# Altium schematic sheet FPGA.SchDoc
size A3; SheetNumber: 2; SheetTotal: 4
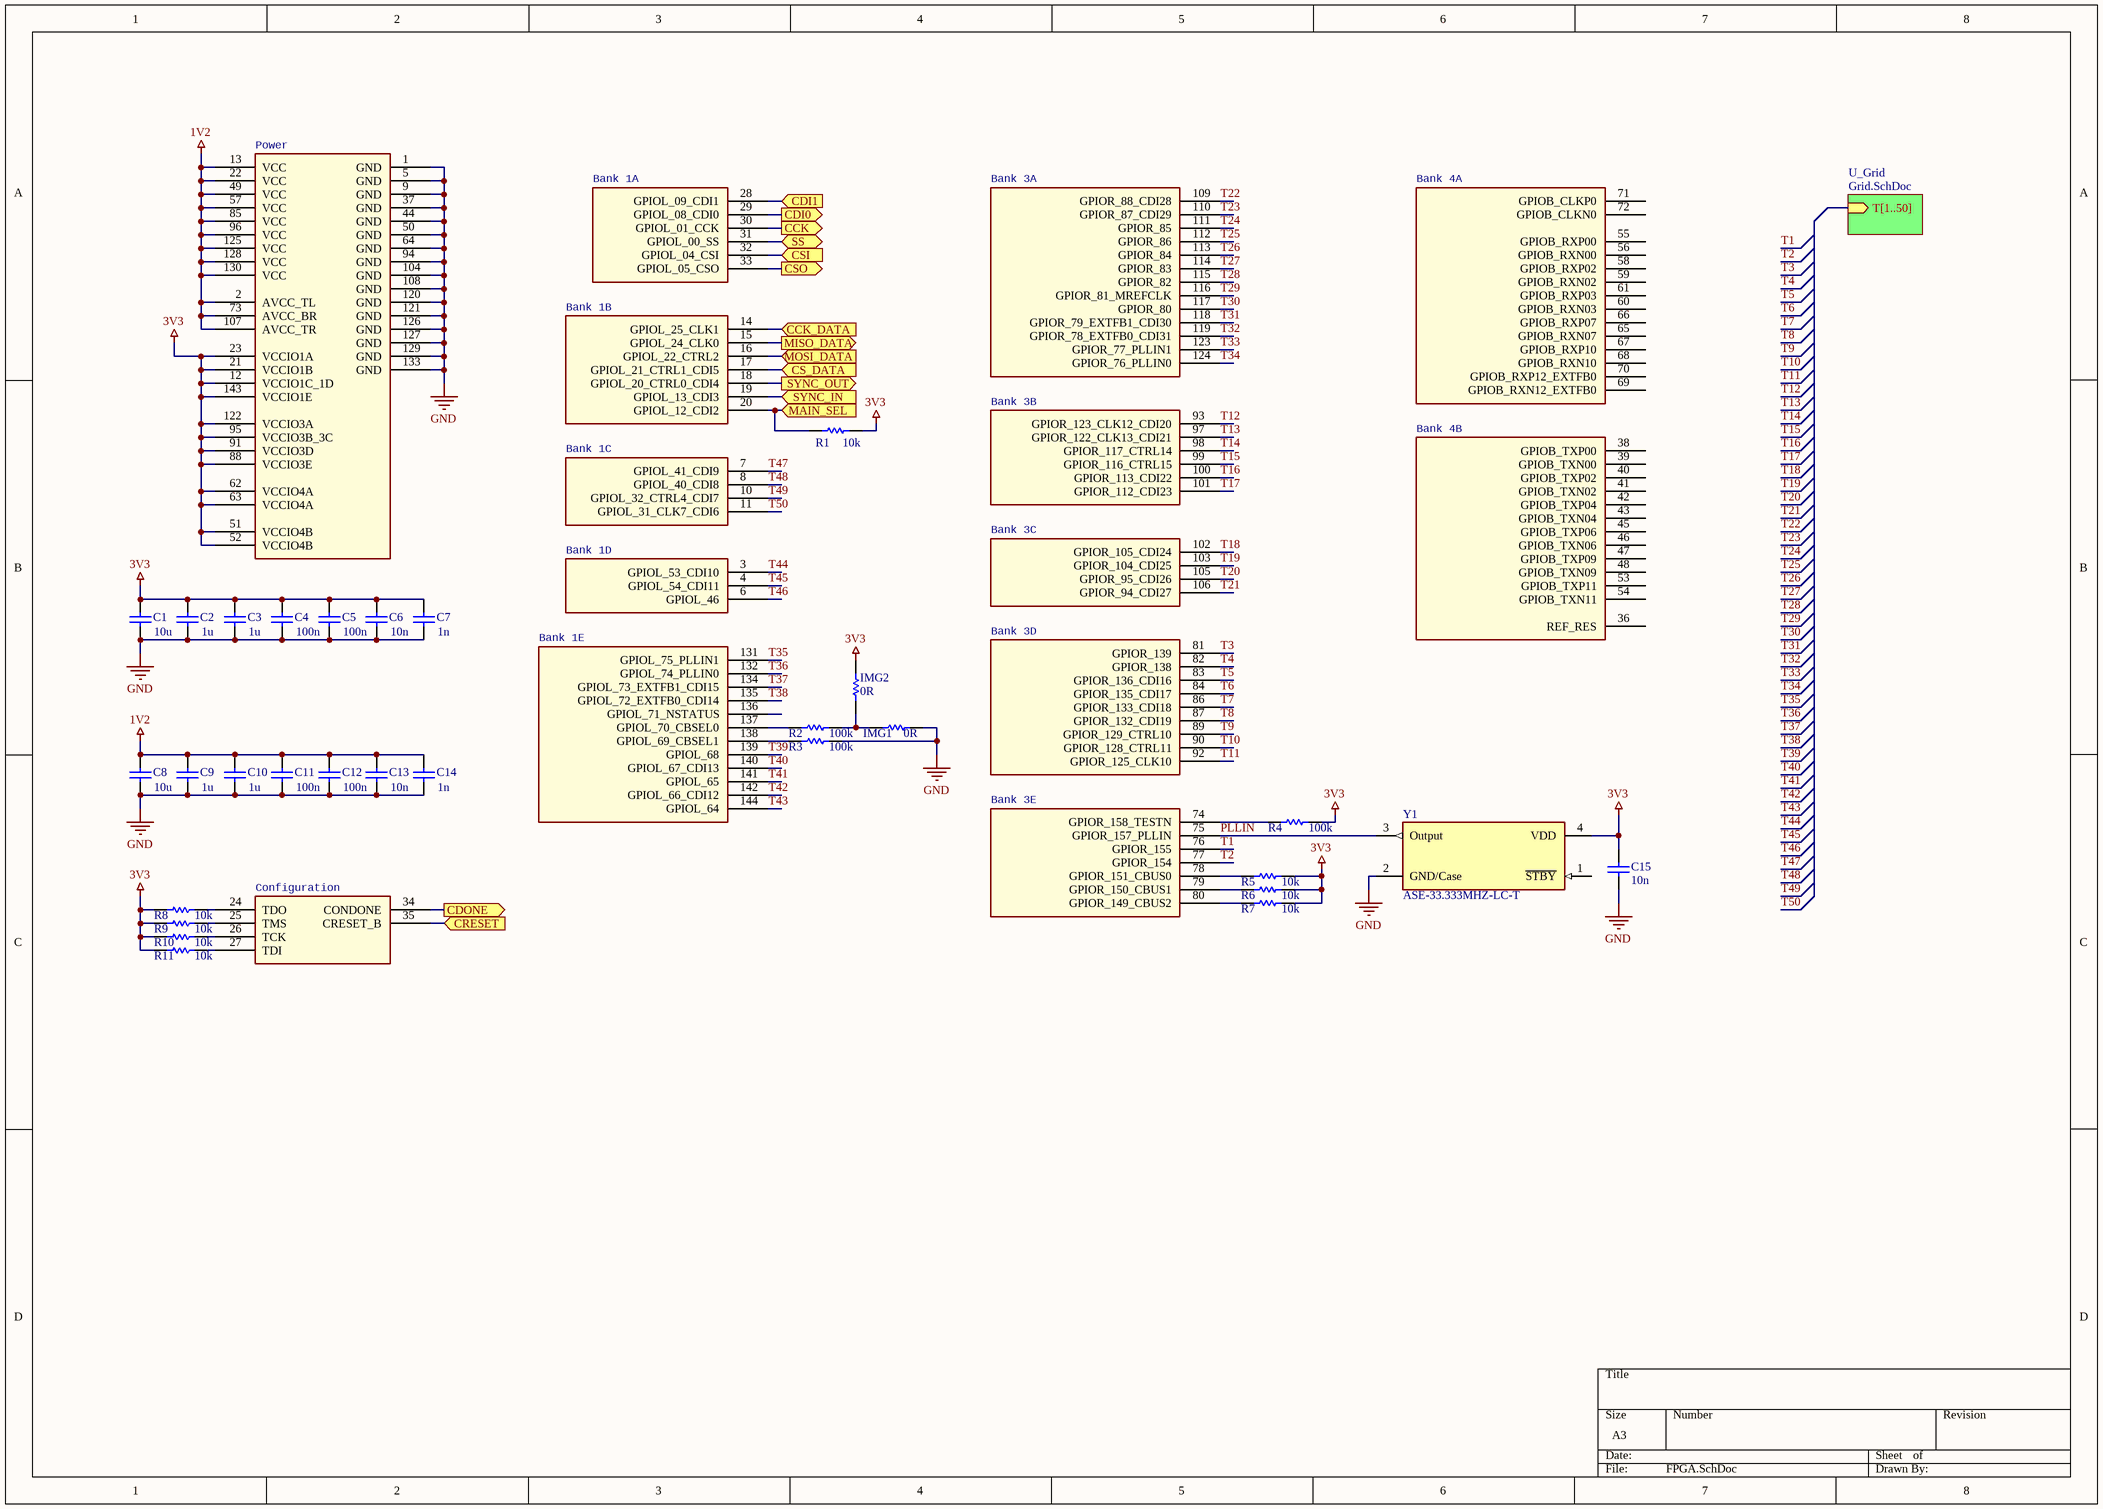
[diagram p0: FPGA.SchDoc]

## Parts
C1  10u  [SAMS-C0603-2_M]
C2  1u  [SAMS-C0603-2_M]
C3  1u  [SAMS-C0603-2_M]
C4  100n  [SAMS-C0603-2_M]
C5  100n  [SAMS-C0603-2_M]
C6  10n  [SAMS-C0603-2_M]
C7  1n  [SAMS-C0603-2_M]
C8  10u  [SAMS-C0603-2_M]
C9  1u  [SAMS-C0603-2_M]
C10  1u  [SAMS-C0603-2_M]
C11  100n  [SAMS-C0603-2_M]
C12  100n  [SAMS-C0603-2_M]
C13  10n  [SAMS-C0603-2_M]
C14  1n  [SAMS-C0603-2_M]
C15  10n  [SAMS-C0603-2_M]
IMG1  0R  [RESC1005X40X20NL05T10]
IMG2  0R  [RESC1005X40X20NL05T10]
R1  10k  [RESC1609X55X30LL15T15]
R2  100k  [RESC1609X55X30LL15T15]
R3  100k  [RESC1609X55X30LL15T15]
R4  100k  [RESC1609X55X30LL15T15]
R5  10k  [RESC1609X55X30LL15T15]
R6  10k  [RESC1609X55X30LL15T15]
R7  10k  [RESC1609X55X30LL15T15]
R8  10k  [RESC1609X55X30LL15T15]
R9  10k  [RESC1609X55X30LL15T15]
R10  10k  [RESC1609X55X30LL15T15]
R11  10k  [RESC1609X55X30LL15T15]
U1  T8Q144Cx  [LQFP144]  (value not drawn)  (parts A,B,C,D,E,F,G,H,I,J,K,L,M,N of 14)
Y1  ASE-33.333MHZ-LC-T  [FP-ASE-MFG]

## Sub-sheets
U_Grid = Grid.SchDoc: T[1..50] (in)

## Ports
CCK (out), CCK_DATA (in), CDI0 (out), CDI1 (in), CDONE (out), CRESET (in), CS_DATA (in), CSI (in), CSO (out), MAIN_SEL (in), MISO_DATA (out), MOSI_DATA (in), SS (bidir), SYNC_IN (in), SYNC_OUT (out)

## Nets
1V2: C8.1 C9.1 C10.1 C11.1 C12.1 C13.1 C14.1 U1.2(AVCC_TL) U1.13(VCC) U1.22(VCC) U1.49(VCC) U1.57(VCC) U1.73(AVCC_BR) U1.85(VCC) U1.96(VCC) U1.107(AVCC_TR) U1.125(VCC) U1.128(VCC) U1.130(VCC)
3V3: C1.1 C2.1 C3.1 C4.1 C5.1 C6.1 C7.1 C15.2 IMG2.2 R1.1 R4.2 R5.2 R6.2 R7.2 R8.1 R9.1 R10.1 R11.1 U1.12(VCCIO1C_1D) U1.21(VCCIO1B) U1.23(VCCIO1A) U1.51(VCCIO4B) U1.52(VCCIO4B) U1.62(VCCIO4A) U1.63(VCCIO4A) U1.88(VCCIO3E) U1.91(VCCIO3D) U1.95(VCCIO3B_3C) U1.122(VCCIO3A) U1.143(VCCIO1E) Y1.4(VDD)
GND: C1.2 C2.2 C3.2 C4.2 C5.2 C6.2 C7.2 C8.2 C9.2 C10.2 C11.2 C12.2 C13.2 C14.2 C15.1 IMG1.2 R3.2 U1.1(GND) U1.5(GND) U1.9(GND) U1.37(GND) U1.44(GND) U1.50(GND) U1.64(GND) U1.94(GND) U1.104(GND) U1.108(GND) U1.120(GND) U1.121(GND) U1.126(GND) U1.127(GND) U1.129(GND) U1.133(GND) Y1.2(GND/Case)
CCK: U1.30(GPIOL_01_CCK) ; port CCK
CCK_DATA: U1.14(GPIOL_25_CLK1) ; port CCK_DATA
CDI0: U1.29(GPIOL_08_CDI0) ; port CDI0
CDI1: U1.28(GPIOL_09_CDI1) ; port CDI1
CDONE: U1.34(CONDONE) ; port CDONE
CRESET: U1.35(CRESET_B) ; port CRESET
CS_DATA: U1.17(GPIOL_21_CTRL1_CDI5) ; port CS_DATA
CSI: U1.32(GPIOL_04_CSI) ; port CSI
CSO: U1.33(GPIOL_05_CSO) ; port CSO
MAIN_SEL: R1.2 U1.20(GPIOL_12_CDI2) ; port MAIN_SEL
MISO_DATA: U1.15(GPIOL_24_CLK0) ; port MISO_DATA
MOSI_DATA: U1.16(GPIOL_22_CTRL2) ; port MOSI_DATA
PLLIN: U1.75(GPIOR_157_PLLIN) Y1.3(Output)
SS: U1.31(GPIOL_00_SS) ; port SS
SYNC_IN: U1.19(GPIOL_13_CDI3) ; port SYNC_IN
SYNC_OUT: U1.18(GPIOL_20_CTRL0_CDI4) ; port SYNC_OUT
T1: U1.76(GPIOR_155)
T2: U1.77(GPIOR_154)
T3: U1.81(GPIOR_139)
T4: U1.82(GPIOR_138)
T5: U1.83(GPIOR_136_CDI16)
T6: U1.84(GPIOR_135_CDI17)
T7: U1.86(GPIOR_133_CDI18)
T8: U1.87(GPIOR_132_CDI19)
T9: U1.89(GPIOR_129_CTRL10)
T10: U1.90(GPIOR_128_CTRL11)
T11: U1.92(GPIOR_125_CLK10)
T12: U1.93(GPIOR_123_CLK12_CDI20)
T13: U1.97(GPIOR_122_CLK13_CDI21)
T14: U1.98(GPIOR_117_CTRL14)
T15: U1.99(GPIOR_116_CTRL15)
T16: U1.100(GPIOR_113_CDI22)
T17: U1.101(GPIOR_112_CDI23)
T18: U1.102(GPIOR_105_CDI24)
T19: U1.103(GPIOR_104_CDI25)
T20: U1.105(GPIOR_95_CDI26)
T21: U1.106(GPIOR_94_CDI27)
T22: U1.109(GPIOR_88_CDI28)
T23: U1.110(GPIOR_87_CDI29)
T24: U1.111(GPIOR_85)
T25: U1.112(GPIOR_86)
T26: U1.113(GPIOR_84)
T27: U1.114(GPIOR_83)
T28: U1.115(GPIOR_82)
T29: U1.116(GPIOR_81_MREFCLK)
T30: U1.117(GPIOR_80)
T31: U1.118(GPIOR_79_EXTFB1_CDI30)
T32: U1.119(GPIOR_78_EXTFB0_CDI31)
T33: U1.123(GPIOR_77_PLLIN1)
T34: U1.124(GPIOR_76_PLLIN0)
T35: U1.131(GPIOL_75_PLLIN1)
T36: U1.132(GPIOL_74_PLLIN0)
T37: U1.134(GPIOL_73_EXTFB1_CDI15)
T38: U1.135(GPIOL_72_EXTFB0_CDI14)
T39: U1.139(GPIOL_68)
T40: U1.140(GPIOL_67_CDI13)
T41: U1.141(GPIOL_65)
T42: U1.142(GPIOL_66_CDI12)
T43: U1.144(GPIOL_64)
T44: U1.3(GPIOL_53_CDI10)
T45: U1.4(GPIOL_54_CDI11)
T46: U1.6(GPIOL_46)
T47: U1.7(GPIOL_41_CDI9)
T48: U1.8(GPIOL_40_CDI8)
T49: U1.10(GPIOL_32_CTRL4_CDI7)
T50: U1.11(GPIOL_31_CLK7_CDI6)
NetIMG1_1: IMG1.1 IMG2.1 R2.2
NetR2_1: R2.1 U1.137(GPIOL_70_CBSEL0)
NetR3_1: R3.1 U1.138(GPIOL_69_CBSEL1)
NetR4_1: R4.1 U1.74(GPIOR_158_TESTN)
NetR5_1: R5.1 U1.78(GPIOR_151_CBUS0)
NetR6_1: R6.1 U1.79(GPIOR_150_CBUS1)
NetR7_1: R7.1 U1.80(GPIOR_149_CBUS2)
NetR8_2: R8.2 U1.24(TDO)
NetR9_2: R9.2 U1.25(TMS)
NetR10_2: R10.2 U1.26(TCK)
NetR11_2: R11.2 U1.27(TDI)

Not connected (* = marked no-connect by the designer): U1 36(REF_RES) 38(GPIOB_TXP00) 39(GPIOB_TXN00) 40(GPIOB_TXP02) 41(GPIOB_TXN02) 42(GPIOB_TXP04) 43(GPIOB_TXN04) 45(GPIOB_TXP06) 46(GPIOB_TXN06) 47(GPIOB_TXP09) 48(GPIOB_TXN09) 53(GPIOB_TXP11) 54(GPIOB_TXN11) 55(GPIOB_RXP00) 56(GPIOB_RXN00) 58(GPIOB_RXP02) 59(GPIOB_RXN02) 60(GPIOB_RXN03) 61(GPIOB_RXP03) 65(GPIOB_RXN07) 66(GPIOB_RXP07) 67(GPIOB_RXP10) 68(GPIOB_RXN10) 69(GPIOB_RXN12_EXTFB0) 70(GPIOB_RXP12_EXTFB0) 71(GPIOB_CLKP0) 72(GPIOB_CLKN0) 136(GPIOL_71_NSTATUS); Y1 1(~{STBY})

## Notes on the sheet
- (in symbol T8Q144Cx, part A) Power
- (in symbol T8Q144Cx, part B) Configuration
- (in symbol T8Q144Cx, part C) Bank 1A
- (in symbol T8Q144Cx, part D) Bank 1B
- (in symbol T8Q144Cx, part E) Bank 1C
- (in symbol T8Q144Cx, part F) Bank 1D
- (in symbol T8Q144Cx, part G) Bank 1E
- (in symbol T8Q144Cx, part H) Bank 3A
- (in symbol T8Q144Cx, part I) Bank 3B
- (in symbol T8Q144Cx, part J) Bank 3C
- (in symbol T8Q144Cx, part K) Bank 3D
- (in symbol T8Q144Cx, part L) Bank 3E
- (in symbol T8Q144Cx, part M) Bank 4A
- (in symbol T8Q144Cx, part N) Bank 4B

## Library data of the parts
C1-C15 = CMP-2000-05332-1: Multi-layer Ceramic Capacitor, -55 to 125 degC, 2-Pin SMD (0603), RoHS, Tape and Reel; Manufacturer: Samsung Electro-Mechanics; Capacitance: 0.1µF; Rated Voltage: 50V; Dielectric: X7R; Tolerance (%): ±10%; Case Size/Dimension: 0603; Datasheet URL: https://datasheet.ciiva.com/29198/456651-da-01-en-vs-kondensator-0605-29198839.pdf; Manufacturer URL: http://www.samsungsem.com/global/index.jsp; Datasheet Version: Nov-10
IMG1 IMG2 = CMP-2002-01682-1: Manufacturer: Vishay BCcomponents; Part Number: TNPW040210K0DEED
R1-R11 = CMP-1012-00623-3: Chip Resistor, 10 KOhm, +/- 1%, 0.1 W, -55 to 155 degC, 0603 (1608 Metric), RoHS, Tape and Reel; Manufacturer: Panasonic; Voltage Rating: 75V; Case\/Package: 0603; Power Rating: 100mW; Resistance: 10KOhm; Temperature Coefficient: 100ppm\/degreesC; Number of Pins: 2; Package Reference: 603; Depth: 0.8mm; Mount: SurfaceMount; Package Description: 2-Pin Surface Mount Device, Body 1.6 x 0.85 mm; Datasheet Version: 02/2017; Length: 1.6mm; Lead Free: LeadFree; Height: 0.45mm; Number of Terminations: 2; Max Power Dissipation: 100mW; Min Operating Temperature: -55degC; Datasheet URL: https://industrial.panasonic.com/cdbs/www-data/pdf/RDA0000/AOA0000C304.pdf; Termination: SMD/SMT; Case Code (Metric): 1608; Case Code (Imperial): 0603; Tolerance: 1%; Max Operating Temperature: 155degC; RoHSCompliant: true; Voltage Rating (DC): 75V; Radiation Hardening: No; Packaging: TapeandReel; Composition: ThickFilm; Mounting Technology: SurfaceMount; Manufacturer URL: http://www.panasonic.com/; Width: 0.031inch; REACH SVHC: NoSVHC; Contact Plating: Tin; Military Standard: Not; Package Quantity: 1
U1 = T8Q144Cx: SPLIT_INST: TRUE; SWAP_INFO: (S1+S2+S3+S4+S5+S6+S7+S8+S9+S10+S11+S12+S13+S14)
Y1 = CMP-27762-010648-1: XTAL Oscillator 33.333MHz ±50ppm CMOS 3.3V 4-SMD 3.2mm x 2.5mm; Max Supply Voltage: 3.465V; Load Capacitance: 15pF; Min Supply Voltage: 3.135V; Max Supply Current: 13mA; Package Quantity: 1000; Frequency: 33.333MHz; Radiation Hardening: No; Case/Package: SMD/SMT; REACH SVHC: No SVHC; Max Operating Temperature: 85°C; Operating Supply Voltage: 3.3V; Depth: 2.5mm; Height: 0.047inch; Mount: Surface Mount; Lead Free: Lead Free; Width: 0.098inch; Packaging: Tape and Reel; Operating Frequency: 33.333 MHz; Series: ASE; Termination: SMD/SMT; Min Operating Temperature: -40°C; Frequency Stability: 50ppm; Number of Pins: 4; Length: 3.2mm